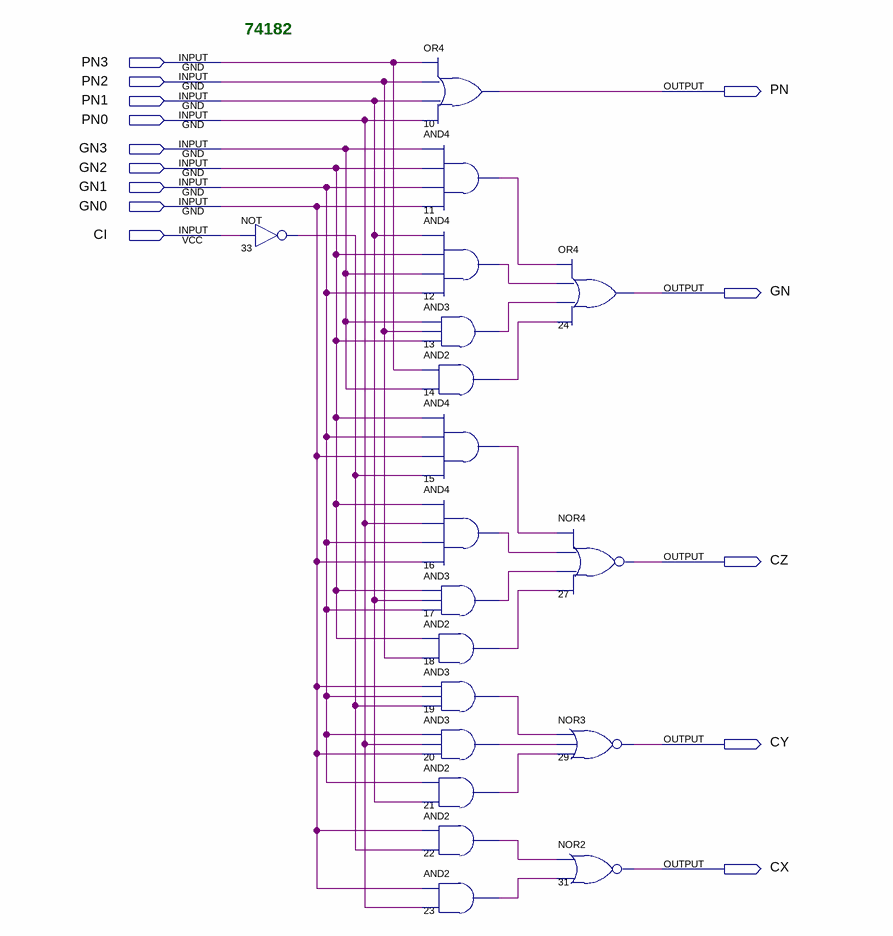
[diagram p0: schematic sheet]
// Quartus schematic ALU_74182.bdf as structural Verilog: 19 symbols, 14 pins
module ALU_74182 (
  input  PN3,
  input  PN2,
  input  PN1,
  input  PN0,
  input  GN3,
  input  GN2,
  input  GN1,
  input  GN0,
  input  CI,
  output PN,
  output GN,
  output CZ,
  output CY,
  output CX
);

  wire n11_out, n12_out, n13_out, n14_out, n15_out, n16_out, n17_out, n18_out, n19_out, n20_out, n21_out,
       n22_out, n23_out, n33_out;

  not u_33 (n33_out, CI);
  or u_10 (PN, PN3, PN2, PN1, PN0);
  and u_11 (n11_out, GN3, GN2, GN1, GN0);
  and u_12 (n12_out, PN1, GN2, GN3, GN1);
  and u_13 (n13_out, GN3, PN2, GN2);
  and u_14 (n14_out, PN3, GN3);
  and u_15 (n15_out, GN2, GN1, GN0, n33_out);
  and u_16 (n16_out, GN2, PN0, GN1, GN0);
  and u_17 (n17_out, GN2, PN1, GN1);
  and u_18 (n18_out, GN2, PN2);
  and u_19 (n19_out, GN0, GN1, n33_out);
  and u_20 (n20_out, GN1, PN0, GN0);
  and u_21 (n21_out, GN1, PN1);
  and u_22 (n22_out, GN0, n33_out);
  and u_23 (n23_out, GN0, PN0);
  or u_24 (GN, n11_out, n12_out, n13_out, n14_out);
  nor u_27 (CZ, n15_out, n16_out, n17_out, n18_out);
  nor u_29 (CY, n19_out, n20_out, n21_out);
  nor u_31 (CX, n22_out, n23_out);

  // Notes on the sheet:
  //   74182
endmodule
